# Altium schematic sheet Motor_Control.SchDoc
size A
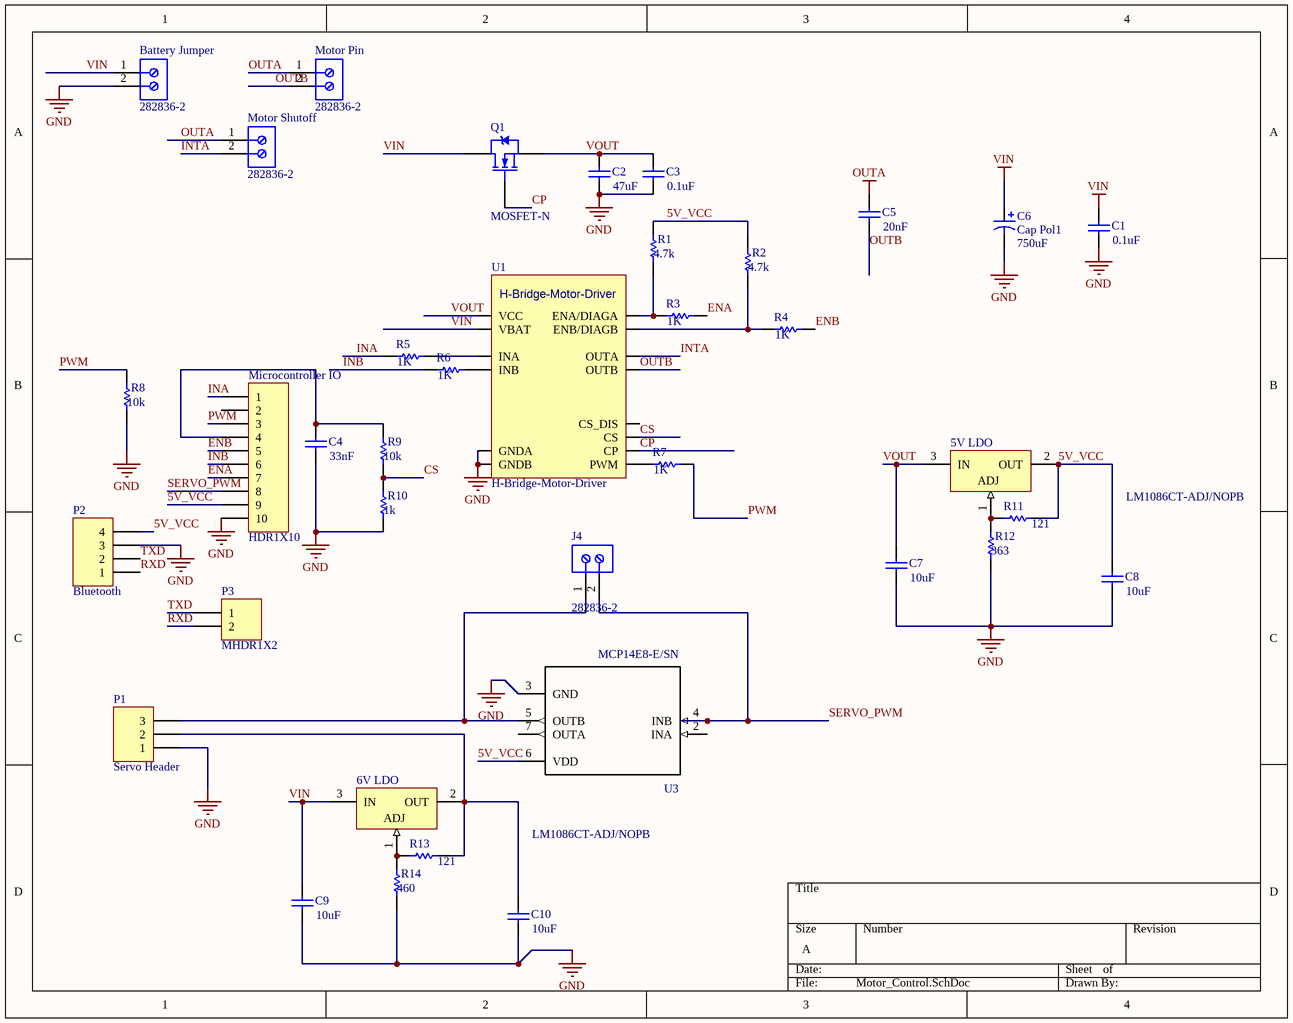
[diagram p0: Motor_Control.SchDoc]

## Parts
5V_LDO  LM1086CT-ADJ/NOPB  [NDE0003A]
6V_LDO  LM1086CT-ADJ/NOPB  [NDE0003A]
Battery_Jumper  282836-2  [TECO-282836-2_V]
C1  value 0.1uF  [RAD-0.3]
C2  value 47uF  [RAD-0.3]
C3  value 0.1uF  [RAD-0.3]
C4  value 33nF  [RAD-0.3]
C5  value 20nF  [RAD-0.3]
C6  Cap Pol1  value 750uF  [RB7.6-15]
C7  value 10uF  [RAD-0.3]
C8  value 10uF  [RAD-0.3]
C9  value 10uF  [RAD-0.3]
C10  value 10uF  [RAD-0.3]
J4  282836-2  [TECO-282836-2_V]
Microcontroller_IO  HDR1X10  [HDR1X10]
Motor_Pin  282836-2  [TECO-282836-2_V]
Motor_Shutoff  282836-2  [TECO-282836-2_V]
P1  Servo Header  [HDR1X3H]
P2  Bluetooth  [HDR1X4]
P3  MHDR1X2  [MHDR1X2]
Q1  MOSFET-N  [TO-220AB]
R1  value 4.7k  [AXIAL-0.3]
R2  value 4.7k  [AXIAL-0.3]
R3  value 1K  [AXIAL-0.3]
R4  value 1K  [AXIAL-0.3]
R5  value 1K  [AXIAL-0.3]
R6  value 1K  [AXIAL-0.3]
R7  value 1K  [AXIAL-0.3]
R8  value 10k  [AXIAL-0.3]
R9  value 10k  [AXIAL-0.3]
R10  value 1k  [AXIAL-0.3]
R11  value 121  [AXIAL-0.3]
R12  value 363  [AXIAL-0.3]
R13  value 121  [AXIAL-0.3]
R14  value 460  [AXIAL-0.3]
U1  H-Bridge-Motor-Driver  [H-Bridge-Motor-Driver]
U3  MCP14E8-E/SN  [*DIP775W47P254L1029H508Q8]

## Nets
GND: Battery_Jumper.2 C1.1 C2.1 C3.1 C4.1 C6.2 C7.1 C8.1 C9.1 C10.1 Microcontroller_IO.10 P1.1 P2.3 R8.2 R10.2 R12.2 R14.2 U1.GNDA U1.GNDB U3.3(GND)
OUTA: C5.2 Motor_Pin.1 Motor_Shutoff.1
VIN: 6V_LDO.3(IN) Battery_Jumper.1 C1.2 C6.1 C9.2 Q1.3(S) U1.VBAT
5V_VCC: 5V_LDO.2(OUT) C8.2 Microcontroller_IO.9 P2.4 R1.1 R2.1 R11.2 U3.6(VDD)
CP: Q1.2(D) U1.CP
CS: R9.2 R10.1 U1.CS
ENA: Microcontroller_IO.7 R3.2
ENB: Microcontroller_IO.5 R4.2
INA: Microcontroller_IO.1 R5.1
INB: Microcontroller_IO.6 R6.1
INTA: Motor_Shutoff.2 U1.OUTA
OUTB: C5.1 Motor_Pin.2 U1.OUTB
PWM: Microcontroller_IO.3 R7.2 R8.1
RXD: P2.1 P3.2
SERVO_PWM: J4.2 Microcontroller_IO.8 U3.4(INB)
TXD: P2.2 P3.1
VOUT: 5V_LDO.3(IN) C2.2 C3.2 C7.2 Q1.1(G) U1.VCC
Net5V_LDO_1: 5V_LDO.1(ADJ) R11.1 R12.1
Net6V_LDO_1: 6V_LDO.1(ADJ) R13.1 R14.1
Net6V_LDO_2: 6V_LDO.2(OUT) C10.2 P1.2 R13.2
NetC4_2: C4.2 Microcontroller_IO.4 R9.1
NetJ4_1: J4.1 P1.3 U3.5(OUTB)
NetR1_2: R1.2 R3.1 U1.ENA/DIAGA
NetR2_2: R2.2 R4.1 U1.ENB/DIAGB
NetR5_2: R5.2 U1.INA
NetR6_2: R6.2 U1.INB
NetR7_1: R7.1 U1.PWM

Not connected (* = marked no-connect by the designer): Microcontroller_IO 2; U1 CS_DIS; U3 2(INA) 7(OUTA)

## Library data of the parts
5V_LDO 6V_LDO = CMP-0062-02525-3: 1.5A Low Dropout Positive Regulators, 3-pin TO-220, Pb-Free; Manufacturer: Texas Instruments; CompType: LDO IC; PackageTopMarking: NSUZXYTTE#*LM1086*CT-ADJ; PowerWise: N; PinCount: 3; ComponentLink1URL: http://www.ti.com/general/docs/lit/getliterature.tsp?genericPartNumber=LM1086&fileType=pdf; PackageReference: NDE0003A; PackageDescription: TO-220, Molded, 3 Lead, Straight; RoHS: Y; ComponentLink1Description: Datasheet URL
Battery_Jumper J4 Motor_Pin Motor_Shutoff = CMP-1684-00017-1: Female Header, Pitch 5 mm, 1 x 2 Position, Height 10 mm, Tail Length 3.5 mm, Rohs, Bulk; Manufacturer: TE Connectivity; Wire Gauge: 16-30AWG; Product Training Modules: Wire-to-BoardEurostyleTerminalBlocks; Clamp Material - Plating: Brass-NickelPlated; Voltage: 300V; Mating Orientation: HorizontalwithBoard; Current: 13.5A; Pitch: 0.197"(5.00mm); Screw Thread: M3; 3D Model: 282836-2.pdf; Other Names: 5ULV-02B / A98076; Dynamic Catalog: BuchananSeries; Number of Levels: 1; Torque - Screw: 0.68Nm(6Lb-In); Featured Product: EurostyleTerminalBlockConnectors; Positions Per Level: 2; Wire Termination: Screw-RisingCageClamp; Datasheet URL: http://www.te.com.cn/commerce/DocumentDelivery/DDEController?Action=showdoc&DocId=Catalog+Section%7F1308389_EUROSTYLE_TERMINAL_BLOCKS%7F0607%7Fpdf%7FEnglish%7FENG_CS_1308389_EUROSTYLE_TERMINAL_BLOCKS_0607.pdf%7F282836-2; Color: Green; Family: TerminalBlocks-WiretoBoard; RoHS Information: 282836-2StatementofCompliance; Standard Package: 300; Contact Material - Plating: Brass-TinPlated; Manufacturer URL: http://www.te.com; Housing Material: Polyamide(PA66),Nylon6/6; Features: Interlocking(Side); Package Description: Female Header, Pitch 5 mm, 1 x 2 Position, Height 10 mm, Tail Length 3.5 mm; Mounting Type: ThroughHole; Package Reference: THD; Packaging: Bulk; Series: Buchanan; Category: Connectors,Interconnects; Screw Material - Plating: Brass-NickelPlated
C1-C5 C7-C10 = Cap: Capacitor; Published: 8-Jun-2000; LatestRevisionDate: 17-Jul-2002; LatestRevisionNote: Re-released for DXP Platform.; PackageReference: RAD-0.3; Publisher: Altium Limited; PackageDescription: Radial Cap, Thru-Hole; 2 Leads; 0.3 in Pin Spacing
C6 = Cap Pol1: Polarized Capacitor (Radial); Published: 8-Jun-2000; LatestRevisionDate: 17-Jul-2002; LatestRevisionNote: Re-released for DXP Platform.; PackageReference: RB7.6-15; Publisher: Altium Limited; PackageDescription: Polarized Capacitor (Radial); 2 Leads
Microcontroller_IO = Header 10: Header, 10-Pin; LatestRevisionDate: 17-Jul-2002; LatestRevisionNote: Re-released for DXP Platform.; Publisher: Altium Limited
P1 = Header 3H: Header, 3-Pin, Right Angle; LatestRevisionDate: 17-Jul-2002; LatestRevisionNote: Re-released for DXP Platform.; Publisher: Altium Limited
P2 = Header 4: Header, 4-Pin; LatestRevisionDate: 17-Jul-2002; LatestRevisionNote: Re-released for DXP Platform.; Publisher: Altium Limited
P3 = MHDR1X2: Header, 2-Pin; LatestRevisionDate: 17-Jul-2002; LatestRevisionNote: Re-released for DXP Platform.; Publisher: Altium Limited
Q1 = NMOS-2: N-Channel Power MOSFET; Note: Pin 2 is electrically connected to pin 4.; Published: 8-Jun-2000; LatestRevisionDate: 17-Jul-2002; LatestRevisionNote: Re-released for DXP Platform.; DatasheetVersion: PD-9.814; PackageVersion: Feb-1997; PackageReference: TO-220AB; Publisher: Altium Limited; PackageDescription: TO, Thru-Hole, Vertical, Heatsink Mounted; 3 In-Line Leads; Pitch 2.54 mm; ComponentLink1Description: Manufacturer Link; ComponentLink1URL: http://www.irf.com/
R1-R14 = Res1: Resistor; Published: 8-Jun-2000; LatestRevisionDate: 17-Jul-2002; LatestRevisionNote: Re-released for DXP Platform.; PackageReference: AXIAL-0.3; Publisher: Altium Limited; PackageDescription: Axial Device, Thru-Hole; 2 Leads; 0.3 in Pin Spacing
U1 = H-Bridge-Motor-Driver: The VHN5019A-E is a full bridge motor driver / intended for a wide range of automotive / applications. The device incorporates a dual / monolithic high-side drivers and two low-side / switches.
U3 = MAX4427MJA: MOSFET DRVR 1.5A 2-OUT Lo Side Non-Inv 8-Pin CDIP N; MF: Maxim Integrated; Package: CDIP-8 Maxim; SnapEDA_Link: https://www.snapeda.com/parts/MAX4427MJA/Maxim%20Integrated/view-part/?ref=snap; Availability: Unavailable; Price: None; MP: MAX4427MJA; Value: *